# EAGLE design c4-tracker (EAGLE 8.7.1)
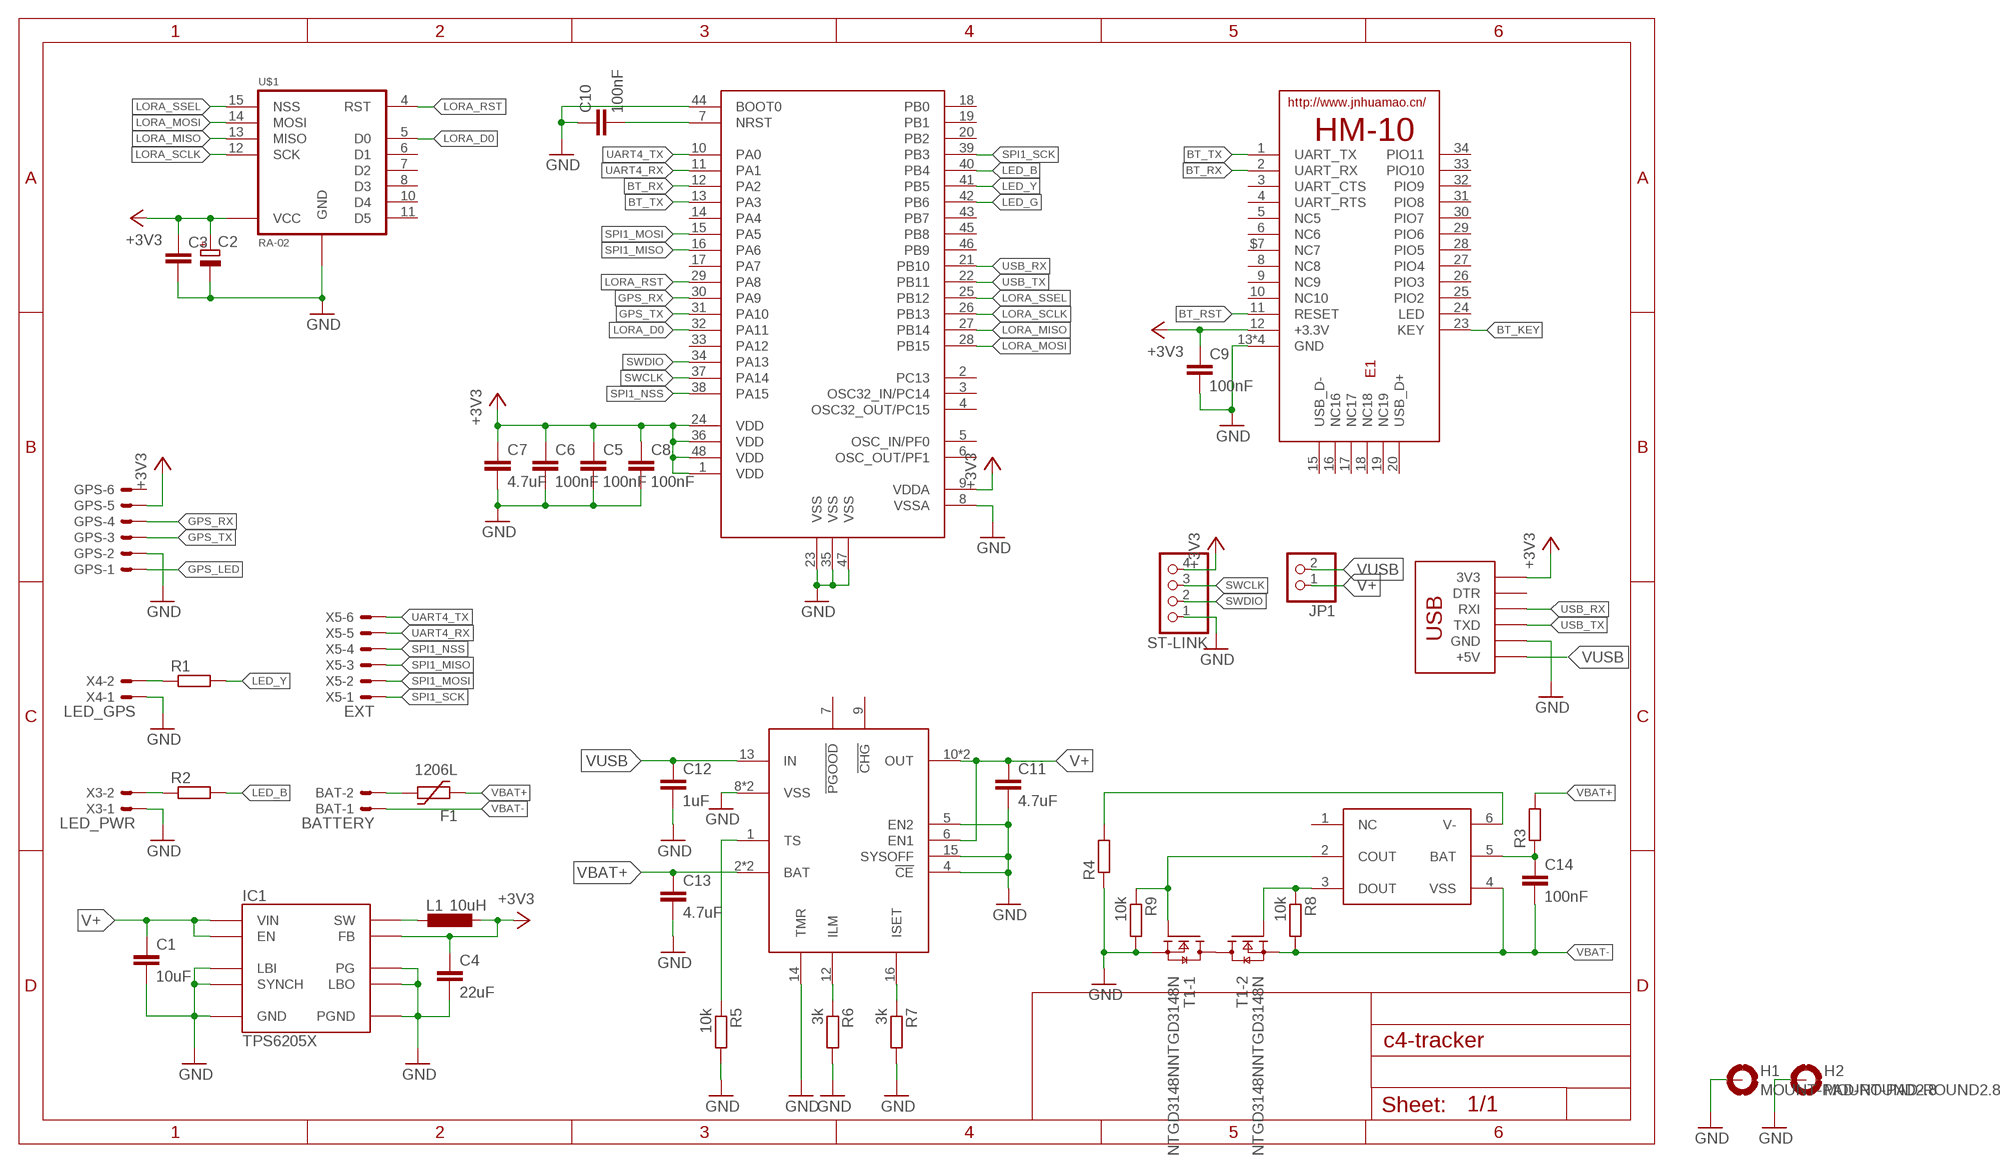
[diagram p0: schematic, sheet 1]

## Parts
BAT  BATTERY  53261-02  [53261-02]
C1  10uF  C-EUC0805  [C0805]
C2  CPOL-EUC  [PANASONIC_C]
C3  C-EUC0805  [C0805]
C4  22uF  C-EUC0805  [C0805]
C5  100nF  C-EUC0805  [C0805]
C6  100nF  C-EUC0805  [C0805]
C7  4.7uF  C-EUC0805  [C0805]
C8  100nF  C-EUC0805  [C0805]
C9  100nF  C-EUC0805  [C0805]
C10  100nF  C-EUC0805  [C0805]
C11  4.7uF  C-EUC0805  [C0805]
C12  1uF  C-EUC0805  [C0805]
C13  4.7uF  C-EUC0805  [C0805]
C14  100nF  C-EUC0805  [C0805]
E1  HM-10-BOARD  [26.9X13X2.2_BOARD]
F1  1206L  [1206L]
GPS  53398-06  [53398-06]
H1  MOUNT-PAD-ROUND2.8  [2,8-PAD]
H2  MOUNT-PAD-ROUND2.8  [2,8-PAD]
IC1  TPS6205X  [VSSOP10]
IC2  BQ24075/9T  [VQFN16]
JP1  PINHD-1X2  [1X02]
L1  10uH  CDRH5D28R  [CDRH5D28R]
MC1  STM32F030CC-48  [LQFP48-7X7]
R1  R-EU_R0805  [R0805]
R2  R-EU_R0805  [R0805]
R3  R-EU_R0805  [R0805]
R4  R-EU_R0805  [R0805]
R5  10k  R-EU_R0805  [R0805]
R6  3k  R-EU_R0805  [R0805]
R7  3k  R-EU_R0805  [R0805]
R8  10k  R-EU_R0805  [R0805]
R9  10k  R-EU_R0805  [R0805]
ST-LINK  PINHD-1X4  [1X04]
T1  NTGD3148NNTGD3148N  [TSOP-6]
U$1  RA-02  [RA-01/RA-02]
U$2  RS232_USB  [CP2102_MICRO_USB_BOARD]
U$3  BQ2970  [WSON6]
X3  LED_PWR  53261-02  [53261-02]
X4  LED_GPS  53261-02  [53261-02]
X5  EXT  53261-06  [53261-06]

## Nets
+3V3: C2.+ C3.1 C4.1 C5.1 C6.1 C7.1 C8.1 C9.1 E1.12(+3.3V) GPS.5 IC1.P$5(FB) L1.1 MC1.1(VDD) MC1.9(VDDA) MC1.24(VDD) MC1.36(VDD) MC1.48(VDD) ST-LINK.4 U$1.3(VCC) U$2.3V3
BT_KEY: E1.23(KEY)
BT_RST: E1.11(RESET)
BT_RX: E1.2(UART_RX) MC1.12(PA2)
BT_TX: E1.1(UART_TX) MC1.13(PA3)
GND: C1.2 C2.- C3.2 C4.2 C5.2 C6.2 C7.2 C8.2 C9.2 C10.1 C11.2 C12.2 C13.2 E1.13(GND) E1.14(GND) E1.21(GND) E1.22(GND) GPS.2 H1.B2,8(MOUNT) H2.B2,8(MOUNT) IC1.P$2(LBO) IC1.P$3(GND) IC1.P$4(PG) IC1.P$6(LBI) IC1.P$7(SYNCH) IC1.P$10(PGND) IC2.4(!CE) IC2.5(EN2) IC2.8(VSS) IC2.14(TMR) IC2.15(SYSOFF) IC2.17(VSS) MC1.8(VSSA) MC1.23(VSS) MC1.35(VSS) MC1.44(BOOT0) MC1.47(VSS) R4.1 R5.2 R6.2 R7.2 R9.2 ST-LINK.1 T1.5(-1:S) U$1.1(GND) U$1.2(GND) U$1.9(GND) U$1.16(GND) U$2.GND X3.1 X4.1
GPS_LED: GPS.1
GPS_RX: GPS.4 MC1.30(PA9)
GPS_TX: GPS.3 MC1.31(PA10)
LED_B: MC1.40(PB4) R2.2
LED_G: MC1.42(PB6)
LED_Y: MC1.41(PB5) R1.2
LORA_D0: MC1.32(PA11) U$1.5(D0)
LORA_MISO: MC1.27(PB14) U$1.13(MISO)
LORA_MOSI: MC1.28(PB15) U$1.14(MOSI)
LORA_RST: MC1.29(PA8) U$1.4(RST)
LORA_SCLK: MC1.26(PB13) U$1.12(SCK)
LORA_SSEL: MC1.25(PB12) U$1.15(NSS)
N$1: C14.1 R3.1 U$3.5(BAT)
N$2: IC1.P$9(SW) L1.2
N$3: IC2.12(ILM) R6.1
N$4: R1.1 X4.2
N$5: BAT.2 F1.P$2
N$6: R2.1 X3.2
N$7: R4.2 U$3.6(V-)
N$8: R9.1 T1.1(-1:G) U$3.2(COUT)
N$9: T1.4(-2:D) T1.6(-1:D)
N$10: R8.1 T1.3(-2:G) U$3.3(DOUT)
N$11: C10.2 MC1.7(NRST)
N$12: IC2.1(TS) R5.1
N$13: IC2.16(ISET) R7.1
SPI1_MISO: MC1.16(PA6) X5.3
SPI1_MOSI: MC1.15(PA5) X5.2
SPI1_NSS: MC1.38(PA15) X5.4
SPI1_SCK: MC1.39(PB3) X5.1
SWCLK: MC1.37(PA14) ST-LINK.3
SWDIO: MC1.34(PA13) ST-LINK.2
UART4_RX: MC1.11(PA1) X5.5
UART4_TX: MC1.10(PA0) X5.6
USB_RX: MC1.21(PB10) U$2.RXI
USB_TX: MC1.22(PB11) U$2.TXD
V+: C1.1 C11.1 IC1.P$1(VIN) IC1.P$8(EN) IC2.6(EN1) IC2.10(OUT) IC2.11(OUT) JP1.1
VBAT+: C13.1 F1.P$1 IC2.2(BAT) IC2.3(BAT) R3.2
VBAT-: BAT.1 C14.2 R8.2 T1.2(-2:S) U$3.4(VSS)
VUSB: C12.1 IC2.13(IN) JP1.2 U$2.+5V
Unconnected: E1.3(UART_CTS) E1.4(UART_RTS) E1.5(NC5) E1.6(NC6) E1.8(NC8) E1.9(NC9) E1.10(NC10) E1.15(USB_D-) E1.16(NC16) E1.17(NC17) E1.18(NC18) E1.19(NC19) E1.20(USB_D+) E1.24(LED) E1.25(PIO2) E1.26(PIO3) E1.27(PIO4) E1.28(PIO5) E1.29(PIO6) E1.30(PIO7) E1.31(PIO8) E1.32(PIO9) E1.33(PIO10) E1.34(PIO11) E1.$7(NC7) GPS.6 IC2.7(!PGOOD) IC2.9(!CHG) MC1.2(PC13) MC1.3(OSC32_IN/PC14) MC1.4(OSC32_OUT/PC15) MC1.5(OSC_IN/PF0) MC1.6(OSC_OUT/PF1) MC1.14(PA4) MC1.17(PA7) MC1.18(PB0) MC1.19(PB1) MC1.20(PB2) MC1.33(PA12) MC1.43(PB7) MC1.45(PB8) MC1.46(PB9) U$1.6(D1) U$1.7(D2) U$1.8(D3) U$1.10(D4) U$1.11(D5) U$2.DTR U$3.1(NC)

## Library data of the parts
BAT X3 X4 = con-molex:53?-02: CONNECTOR wire to board 1.25 mm (.049 inch) pitch header
C1 C3-C14 = rcl:C-EU: CAPACITOR, European symbol; SPICEPREFIX: C
C2 = rcl:CPOL-EU: POLARIZED CAPACITOR, European symbol; SPICEPREFIX: C
E1 = misc:HM-10: HM Bluetooth module use TI CC2540 or CC2541, Master and slave roles in one, transmission version and remote control version and PIO state acquisition functions in one, Support the AT command modify module parameters, Convenient and flexible.
F1 = ptc-littlefuse:1206L
GPS X5 = con-molex:53?-06: CONNECTOR wire to board 1.25 mm (.049 inch) pitch header
H1 H2 = holes:MOUNT-PAD-ROUND: MOUNTING PAD, round
IC1 = misc:TPS6205X
IC2 = misc:BQ24075/9T
JP1 = pinhead:PINHD-1X2: PIN HEADER
L1 = misc:CDRH5D28R
MC1 = stm32:STM32F030CC-48
R1-R9 = rcl:R-EU_: RESISTOR, European symbol; SPICEPREFIX: R
ST-LINK = pinhead:PINHD-1X4: PIN HEADER
T1 = misc:NTGD3148N: 20 V, dual N-channel Trench MOSFET AAL Eindhoven MK
U$1 = lora:RA-02
U$2 = misc:RS232_USB
U$3 = misc:BQ2970

## Board
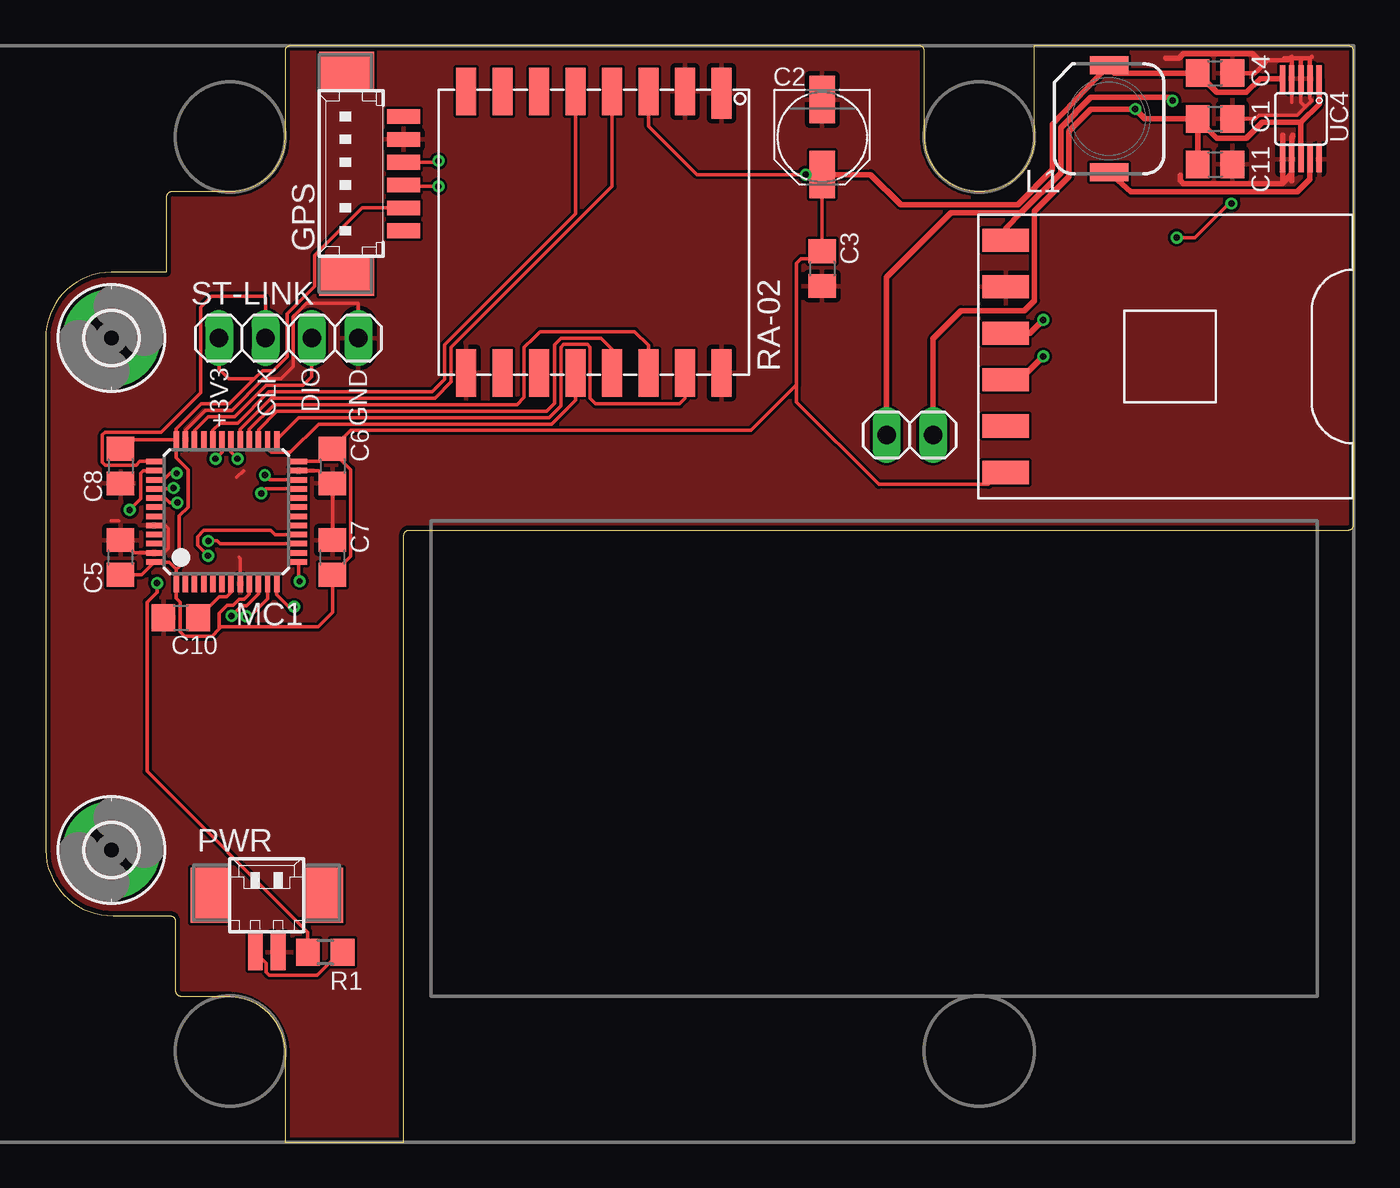
[diagram p1: board, top side]
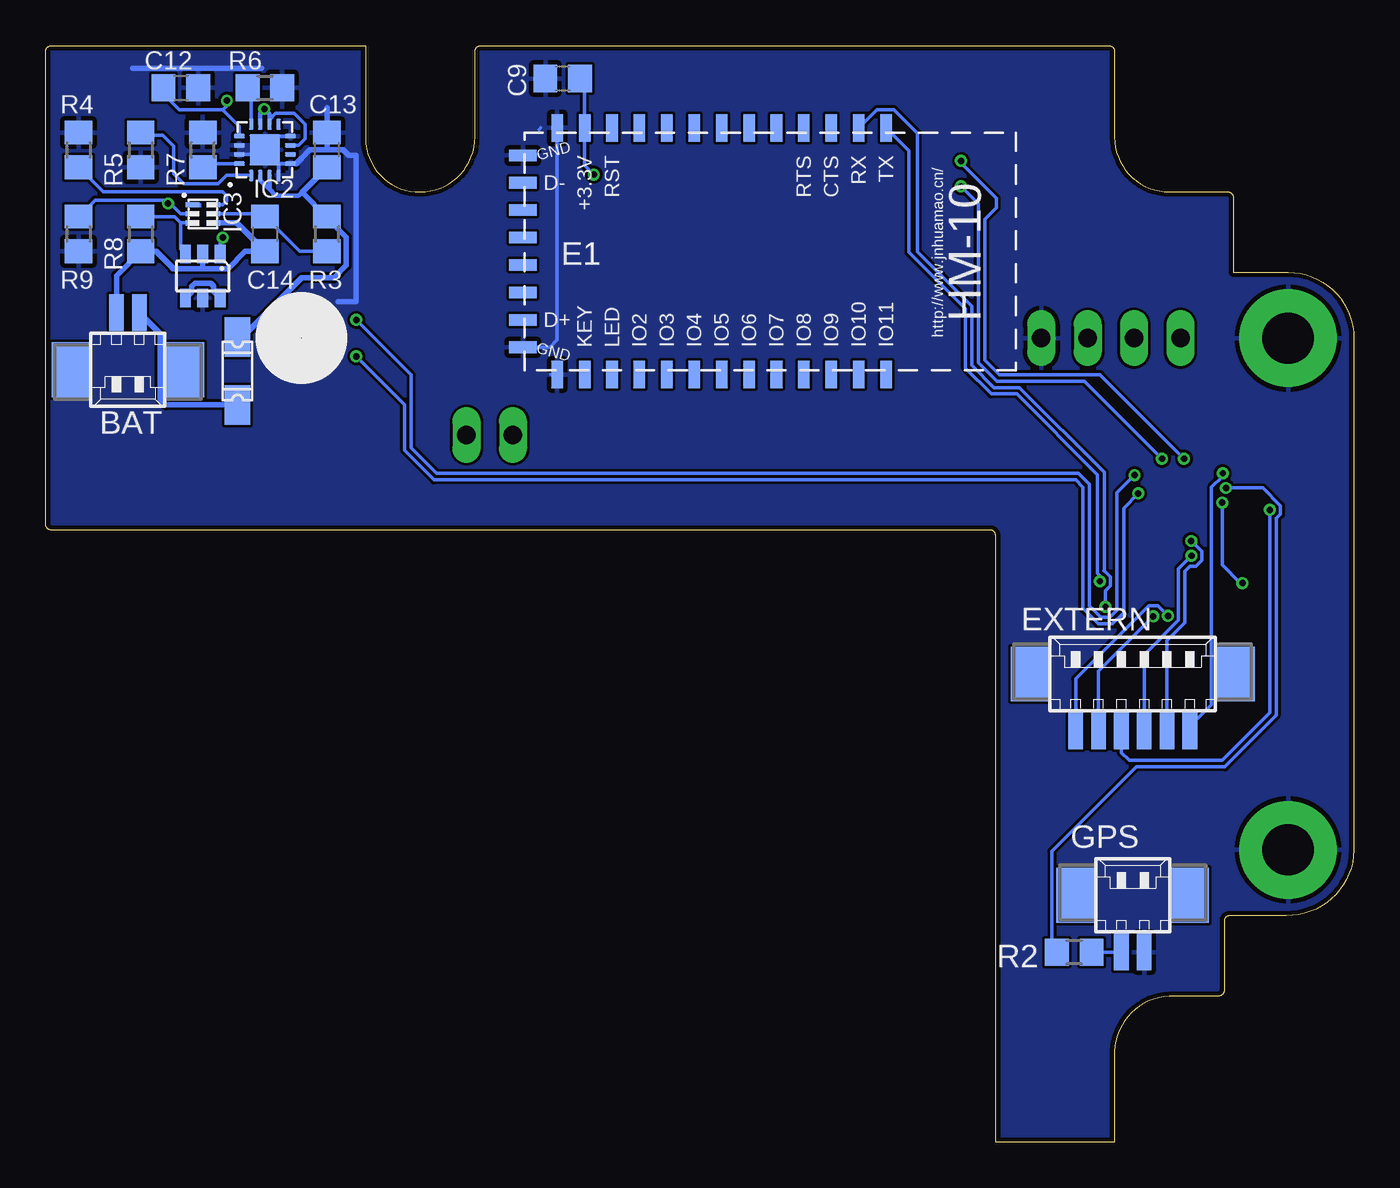
[diagram p2: board, bottom side, seen from below]

Size 71.6 x 60 mm. Coordinates in mm from the lower left corner, seen from the top.
Outline: 0,16 arc90 3.7,12.4 6.8,12.4 arc-90 7.1,12.1 7.1,8.3 arc90 7.4,8 10.1,8 arc-90 13.1,4.7 13.1,0 19.6,0 19.6,33.2 arc-90 19.9,33.5 71.3,33.5 arc90 71.6,33.8 71.6,59.7 arc90 71.3,60 54.1,60 54.1,54.9 arc-90 51.1,52 arc-90 48.1,55 48.1,59.7 arc90 47.8,60 13.4,60 arc90 13.1,59.7 13.1,55 arc-90 10.1,52 6.9,52 arc90 6.6,51.7 6.6,47.6 3.6,47.6 arc90 0,44 0,16
Copper layers (1*16): Top 0.035mm / dielectric 1.5mm / Bottom 0.035mm
Design rules "SeeedStudio_2layer_DRU_no_angle_20140221": minimum track width 6mil, minimum drill 12mil, track to track 6mil, track to pad 6mil, pad to pad 6mil, via to via 6mil, smd to smd 0mil, copper to edge 10mil, drill to drill 10mil, minimum pad ring 10mil, minimum via ring 6mil, stop-mask expansion 2mil, vias tented up to drill 100mil, thermal gap 10mil

### Footprints (pad centres in the part's own frame; a part is rotated, then mirrored left to right if it is on the bottom)
53261-02 = smd 0.8 x 2: 1 0.625,-2.5; 2 -0.625,-2.5 | smd 2.1 x 3: S1 3.125,0.625; S2 -3.125,0.625
C0805 = smd 1.3 x 1.5: 1 -0.95,0; 2 0.95,0
PANASONIC_C = smd 2.6 x 1.4: + 2.05,0; - -2.05,0
26.9X13X2.2_BOARD = smd 1.5 x 0.635: 1 -7.5,0; 2 -7.5,-1.5; 3 -7.5,-3; 4 -7.5,-4.5; 5 -7.5,-6; 6 -7.5,-7.5; 8 -7.5,-10.5; 9 -7.5,-12; 10 -7.5,-13.5; 11 -7.5,-15; 12 -7.5,-16.5; 13 -7.5,-18; 22 6,-18; 23 6,-16.5; 24 6,-15; 25 6,-13.5; 26 6,-12; 27 6,-10.5; 28 6,-9; 29 6,-7.5; 30 6,-6; 31 6,-4.5; 32 6,-3; 33 6,-1.5; 34 6,0; $7 -7.5,-9 | smd 0.635 x 1.5: 14 -6,-19.875; 15 -4.5,-19.875; 16 -3,-19.875; 17 -1.5,-19.875; 18 0,-19.875; 19 1.5,-19.875; 20 3,-19.875; 21 4.5,-19.875
1206L = smd 2.16 x 1.4: P$1 -1.85,0; P$2 1.85,0
53398-06 = smd 0.8 x 1.8: 1 3.125,-2.5; 2 1.875,-2.5; 3 0.625,-2.5; 4 -0.625,-2.5; 5 -1.875,-2.5; 6 -3.125,-2.5 | smd 2.1 x 3: S1 5.625,0.625; S2 -5.625,0.625
2,8-PAD = drill 2.8 pad 5.334: B2,8 0,0
VSSOP10 = smd 0.3 x 1.45: P$1 -1,-2.2; P$2 -0.5,-2.2; P$3 0,-2.2; P$4 0.5,-2.2; P$5 1,-2.2; P$6 1,2.2; P$7 0.5,2.2; P$8 0,2.2; P$9 -0.5,2.2; P$10 -1,2.2
VQFN16 = smd 0.6 x 0.24: 1 -1.4,0.75; 2 -1.4,0.25; 3 -1.4,-0.25; 4 -1.4,-0.75; 9 1.4,-0.75; 10 1.4,-0.25; 11 1.4,0.25; 12 1.4,0.75 | smd 0.24 x 0.6: 5 0.75,-1.4; 6 0.25,-1.4; 7 -0.25,-1.4; 8 -0.75,-1.4; 13 0.75,1.4; 14 0.25,1.4; 15 -0.25,1.4; 16 -0.75,1.4 | smd 1.68 x 1.68: 17 0,0
1X02 = drill 1.016 long: 1 -1.27,0; 2 1.27,0
CDRH5D28R = smd 2.1 x 1: 1 0,2.927; 2 0,-2.927
LQFP48-7X7 = smd 0.9 x 0.3: 1 -3.95,2.75; 2 -3.95,2.25; 3 -3.95,1.75; 4 -3.95,1.25; 5 -3.95,0.75; 6 -3.95,0.25; 7 -3.95,-0.25; 8 -3.95,-0.75; 9 -3.95,-1.25; 10 -3.95,-1.75; 11 -3.95,-2.25; 12 -3.95,-2.75; 25 3.95,-2.75; 26 3.95,-2.25; 27 3.95,-1.75; 28 3.95,-1.25; 29 3.95,-0.75; 30 3.95,-0.25; 31 3.95,0.25; 32 3.95,0.75; 33 3.95,1.25; 34 3.95,1.75; 35 3.95,2.25; 36 3.95,2.75 | smd 0.3 x 0.9: 13 -2.75,-3.95; 14 -2.25,-3.95; 15 -1.75,-3.95; 16 -1.25,-3.95; 17 -0.75,-3.95; 18 -0.25,-3.95; 19 0.25,-3.95; 20 0.75,-3.95; 21 1.25,-3.95; 22 1.75,-3.95; 23 2.25,-3.95; 24 2.75,-3.95; 37 2.75,3.95; 38 2.25,3.95; 39 1.75,3.95; 40 1.25,3.95; 41 0.75,3.95; 42 0.25,3.95; 43 -0.25,3.95; 44 -0.75,3.95; 45 -1.25,3.95; 46 -1.75,3.95; 47 -2.25,3.95; 48 -2.75,3.95
R0805 = smd 1.3 x 1.5: 1 -0.95,0; 2 0.95,0
1X04 = drill 1.016 long: 1 -3.81,0; 2 -1.27,0; 3 1.27,0; 4 3.81,0
TSOP-6 = smd 0.6 x 1: 1 -0.95,-1.2; 2 0,-1.2; 3 0.95,-1.2; 4 0.95,1.2; 5 0,1.2; 6 -0.95,1.2
RA-01/RA-02 = smd 2.8 x 1.1: 1 -7.6,7 | smd 2.6 x 1.1: 2 -7.7,5; 3 -7.7,3; 4 -7.7,1; 5 -7.7,-1; 6 -7.7,-3; 7 -7.7,-5; 8 -7.7,-7; 9 7.7,-7; 10 7.7,-5; 11 7.7,-3; 12 7.7,-1; 13 7.7,1; 14 7.7,3; 15 7.7,5; 16 7.7,7
CP2102_MICRO_USB_BOARD = smd 2.54 x 1.27: 3V3 8.75,6.35; +5V 8.75,-6.35; DTR 8.75,3.81; GND 8.75,-3.81; RXI 8.75,1.27; TXD 8.75,-1.27
WSON6 = smd 0.28 x 0.75: 1 -0.5,-0.575; 2 0,-0.575; 3 0.5,-0.575; 4 0.5,0.575; 5 0,0.575; 6 -0.5,0.575
53261-06 = smd 0.8 x 2: 1 3.125,-2.5; 2 1.875,-2.5; 3 0.625,-2.5; 4 -0.625,-2.5; 5 -1.875,-2.5; 6 -3.125,-2.5 | smd 2.1 x 3: S1 5.625,0.625; S2 -5.625,0.625

### Placement (x,y rotation side)
BAT  67.1,42.9 180 bottom
C1  64,56 0 top
C2  42.5,55 270 top
C3  42.5,47.8 270 top
C4  64,58.5 0 top
C5  4.1,32 90 top
C6  15.7,37 270 top
C7  15.7,32 90 top
C8  4.1,37 270 top
C9  43.3,58.2 180 bottom
C10  7.4,28.7 0 top
C11  64,53.5 0 top
C12  64.2,57.7 0 bottom
C13  56.2,54.3 90 bottom
C14  59.6,49.7 270 bottom
E1  25.6,48 270 bottom
F1  61.1,42.2 270 bottom
GPS  17.1,53 90 top
H1  3.6,16 0 top
H2  3.6,44 0 top
IC1  68.7,56 180 top
IC2  59.6,54.3 90 bottom
JP1  47.3,38.7 180 top
L1  58.2,56 0 top
MC1  9.9,34.5 90 top
R1  15.3,10.4 180 top
R2  15.3,10.4 180 bottom
R3  56.2,49.7 90 bottom
R4  69.8,54.3 270 bottom
R5  66.4,54.3 270 bottom
R6  59.6,57.7 0 bottom
R7  63,54.3 90 bottom
R8  66.4,49.7 270 bottom
R9  69.8,49.7 270 bottom
ST-LINK  13.3,44 180 top
T1  63,47.4 180 bottom
U$1  30,49.8 270 top
U$2  61.3,43 180 top
U$3  63,50.8 270 bottom
X3  12.1,12.9 0 bottom
X4  12.1,12.9 0 top
X5  12.1,25 0 bottom

### Tracks (layer width: path | path; a pad name or v marks a point on that pad's centre or on a via)
+3V3  (via drill 0.35)
  Top 0.2: 7.2,30.6 MC1.1 | C6.1 16.1,37.81 | 16.1,31.19 C7.1 | C6.1 15.83,38.08 15.83,37.68 16.7,36.8 16.7,32.05 C7.1 | MC1.24 15,37.25 C6.1 | 4.62,38.48 C8.1 4.6,38.45 MC1.36 | 9.5,44.51 ST-LINK.4 9.49,42.29 10.01,41.77 11.42,41.77 | MC1.1 7.15,31.35 | 7.15,31.35 6.75,31.75 MC1.48 5.25,31.05 C5.1 | MC1.36 7.15,39.05 8.51,40.41 10.06,40.41 11.42,41.77 | MC1.36 7.15,37.45 7.79,36.81 7.79,34.76 7.3,34.27 7.3,31.5 7.15,31.35 | C6.1 16.7,38.95 38.6,38.95 41.1,41.45 | C7.1 15.7,29 14.9,28.2 9.61,28.2 9.5,28.1 | MC1.1 7.15,29.76 7.35,29.55 7.35,27.94 7.6,27.7 9.1,27.7 9.5,28.1 | 41.1,41.45 41.1,48.1 41.35,48.35 42.1,48.35 C3.1 C2.+ v41.6,52.95 35.65,52.95 33,55.6 U$1.3 | 11.42,41.77 11.87,42.22 12.45,42.22 13.2,42.98 13.2,45.33 14.72,46.85 14.72,48.53 17.32,51.12 GPS.5 | U$2.3V3 52.55,36.95 51.6,36 45.6,36 41.1,40.5 41.1,41.45 | MC1.9 11.15,30 10.86,29.71 10.59,29.71 10.26,29.38 9.93,29.38 9.5,28.95 9.5,28.1
  Top 0.3: IC1.P$5 66.48,58.2 65.72,57.45 64.1,57.45 C4.1 58.5,58.5 L1.1 55.1,55.7 55.1,53.2 53.2,51.3 46.8,51.3 45.15,52.95 C2.+
  Bottom 0.2: 42.1,55.99 E1.12 | 42.18,55.5 E1.12 | E1.12 42.1,57.95 C9.1 | E1.12 42.1,53.45 v41.6,52.95
BT_RX  (via drill 0.35)
  Top 0.2: MC1.12 12.65,29.95 13.3,29.3 v13.6,29.3
  Bottom 0.2: 22.6,47.45 23.87,48.73 23.87,55.2 25.18,56.5 26.1,56.5 E1.2 | 22.6,47.45 22.59,47.46 | 22.6,47.45 20.91,45.76 20.91,42.51 19.69,41.3 18.3,41.3 13.66,36.66 13.66,31.28 | 13.66,31.28 13.32,30.94 13.32,30.46 13.6,30.18 v13.6,29.3 | 13.66,31.28 13.68,31.28
BT_TX  (via drill 0.35)
  Top 0.2: MC1.13 13.85,30.75 v13.9,30.7
  Bottom 0.2: E1.1 24.35,54.25 24.35,48.71 21.26,45.61 21.26,42.36 19.84,40.94 18.44,40.94 14.03,36.53 14.03,31.13 13.9,31 v13.9,30.7
GND
  Top 0.2: 42.5,46.99 C3.2 42.48,46.83 42.5,46.8 42.5,46.35 | C7.2 16.02,33.02 | 10.47,36.38 10.84,36.75 | C6.2 15.7,36 | 15.7,36 C7.2 | 15.7,32.81 C7.2 | MC1.23 14.95,36.75 15.7,36 | 4,34 3.6,34 | ST-LINK.1 17.1,45.9 14.27,45.9 13.56,45.18 13.56,42.42 12.9,41.77 11.92,41.77 10.2,40.05 8.76,40.05 7.65,38.95 MC1.35 | C5.2 4.8,32.25 MC1.47 6.45,32.25 6.7,32.5 6.7,33.6 6.55,33.75 MC1.44 | IC1.P$4 68.2,56.9 | IC1.P$2 69.2,57.1 69.3,57 68.95,56.65 | 68.95,56.65 68.5,56.2 66.41,56.2 66.21,56 C1.2 | MC1.8 10.65,31.95 10.6,32 | IC1.P$3 68.7,56.9 68.95,56.65
  Top 0.254: IC1.P$4 68.2,59.4 68,59.2 67.7,59.2 | C4.2 66.17,58.5 66.63,58.97 66.88,59.2 67.7,59.2 | IC1.P$3 68.7,59.2 68.8,59.3 | 68.8,59.3 67.8,59.3 67.7,59.2 | IC1.P$2 69.2,59.3 | 69.3,59.4 69.2,59.3 | 69.2,59.3 68.8,59.3
  Top 0.3: 68.2,53 IC1.P$7 68.2,55 68.25,55.05 68.25,55.1 | 68.2,53 68.2,52.6 | 67.7,52.6 IC1.P$6 67.7,55.1 | 62.1,52.9 62.1,52.62 62.27,52.45 67.65,52.45 68.2,53 | 61.3,59.3 62.02,59.3 62.27,59.55 66.05,59.55 66.63,58.97
  Bottom 0.152: E1.22 43.98,42
  Bottom 0.2: 44.5,55.5 44.6,55.4 | 43.6,55.6 43.6,43.9 44,43.5 E1.21 | IC2.8 58.85,53.55 | 58.85,53.55 IC2.17 | IC2.4 58.85,53.55 | IC2.5 58.85,55.05 IC2.17 | IC2.17 60.1,53.8 60.35,54.05 IC2.15
  Bottom 0.3: 59.77,58.75 66.85,58.75 | 57.88,53.55 57.6,53.83 57.6,53.85 57.15,54.3 56.2,54.3 | 55.6,46 54.6,46 54.6,54 55.02,54 55.32,54.3 56.2,54.3 | 56.2,56.6 C13.2 56.2,54.3
  pour Top: -10.4,60 -10.4,0 71.6,0 71.6,60
  pour Bottom: -10.4,60 71.6,60 71.6,0 -10.4,0
GPS_RX  (via drill 0.35)
  Top 0.2: MC1.30 10.15,37.75 v10.5,37.4 | GPS.4 19.67,52.3 v21.5,52.3
  Bottom 0.2: v10.5,37.4 14.75,41.65 19.55,41.65 20.55,42.65 20.55,51.35 v21.5,52.3
GPS_TX  (via drill 0.35)
  Top 0.2: MC1.31 9.65,37.75 v9.3,37.4 | GPS.3 21.42,53.62 v21.5,53.7
  Bottom 0.2: v9.3,37.4 13.9,42 19.4,42 20.2,42.8 20.2,50.51 19.57,51.14 19.57,51.66 21.5,53.59 v21.5,53.7
LED_B  (via drill 0.35)
  Top 0.2: MC1.40 6.95,35.75 v7,35.8
  Bottom 0.2: v7,35.8 4.98,35.8 4.02,34.84 4.02,34.36 4.25,34.13 4.25,23.35 6.9,20.7 7.05,20.55 11.9,20.55 16.53,15.92 16.53,10.68 R2.2
LED_Y  (via drill 0.35)
  Top 0.2: v7.21,35 6.8,35 6.55,35.25 MC1.41 | R1.2 14.35,11.49 5.55,20.3 5.55,29.55 6.1,30.11 v6.1,30.6
  Bottom 0.2: v7.21,35 7.21,31.61 6.2,30.6 v6.1,30.6
LORA_D0
  Top 0.2: MC1.32 9.15,38.95 9.55,39.35 10.49,39.35 12.21,41.06 21.16,41.06 21.84,41.75 21.84,43.65 29,50.8 U$1.5
LORA_MISO
  Top 0.2: MC1.27 11.65,39 12.65,40.01 27.41,40.01 27.84,40.44 27.84,43.65 28.2,44.01 30.4,44.01 31,43.4 U$1.13
LORA_MOSI
  Top 0.2: MC1.28 11.15,39.01 12.5,40.36 25.8,40.36 26.2,40.76 26.2,43.51 26.69,44 26.7,44 27.06,44.36 32.24,44.36 33,43.6 U$1.14
LORA_RST
  Top 0.2: MC1.29 10.65,39.01 12.35,40.71 21.31,40.71 22.2,41.6 22.2,43.51 31,52.31 U$1.4
LORA_SCLK
  Top 0.2: MC1.26 12.15,37.95 12.35,37.75 13.39,37.75 14.94,39.3 27.7,39.3 29,40.6 U$1.12
LORA_SSEL
  Top 0.2: 12.7,38.4 MC1.25 13.85,39.65 27.55,39.65 28.2,40.3 28.2,43.51 28.34,43.65 29.66,43.65 29.8,43.51 29.8,40.7 30.1,40.4 34.7,40.4 34.95,40.65 35,40.7 U$1.15
N$1
  Bottom 0.2: R3.1 57.7,48.75 C14.1 59.75,50.8 U$3.5
N$2
  Top 0.3: IC1.P$9 69.2,52.7 68.49,51.99 59.41,51.99 L1.2
N$3
  Bottom 0.2: IC2.12 60.35,57.5 R6.1
N$4
  Top 0.2: R1.1 16.11,10.4 14.85,9.15 12.22,9.15 12.07,9.29 12.07,9.8 X4.2
N$5
  Bottom 0.3: F1.P$2 65.03,40.35 65.33,40.65 65.33,44.25 BAT.2
N$6
  Bottom 0.2: R2.1 X3.2
N$7
  Bottom 0.2: R4.2 68.45,52 63.6,52 63.13,52 61.9,52 61.7,51.8 61.7,51.5 61.9,51.3 U$3.6
N$8  (via drill 0.35)
  Top 0.2: v61.9,49.5 62.9,49.5 64.7,51.3 64.83,51.3 v64.9,51.37
  Bottom 0.2: U$3.2 64.2,50.8 64.9,51.5 | R9.1 68.9,51.55 64.95,51.55 64.9,51.5 | T1.1 62.05,49.35 v61.9,49.5 | v64.9,51.37 64.9,51.5
N$9
  Bottom 0.3: T1.6 62.4,46.55 62.4,46.83 62.57,47 63.43,47 63.6,46.83 63.6,46.55 T1.4
N$10
  Bottom 0.2: U$3.3 64,50.3 | 64,50.3 U$3.3 | 64.2,50.3 U$3.3 | T1.3 64.2,48.85 64.2,50.3 | 64.2,50.3 64.55,50.65 R8.1
N$11
  Top 0.2: C10.2 9.5,29.85 9.9,29.85 10.15,30.09 MC1.7
N$12
  Bottom 0.2: IC2.1 61.69,52.9 62.15,52.45 64.05,52.45 64.6,53 64.6,54.5 65.2,55.1 66.25,55.1 R5.1
N$13
  Bottom 0.2: IC2.16 62.8,53.55 R7.1
SPI1_MISO  (via drill 0.35)
  Top 0.2: v8.89,32.09 8.32,32.66 8.32,33.14 8.66,33.48 12.32,33.48 12.55,33.25 MC1.16
  Bottom 0.2: 11.18,21.7 11.5,21.7 11.5,22.48 X5.3 11.47,22.7 11.47,23.07 11.47,26.68 9.59,28.56 9.59,31.39 v8.89,32.09
SPI1_MOSI  (via drill 0.35)
  Top 0.2: MC1.15 9.55,32.75 9.4,32.9 v8.9,32.9
  Bottom 0.2: 10.22,21.93 X5.2 10.22,27.43 9.24,28.41 9.24,31.24 8.97,31.51 8.65,31.51 8.31,31.85 8.31,32.33 8.65,32.67 8.67,32.67 v8.9,32.9
SPI1_NSS  (via drill 0.35)
  Top 0.2: v4.6,34.6 5.2,35.2 5.2,36.6 5.35,36.75 MC1.38
  Top 0.3: 4.6,34.72 v4.6,34.6
  Bottom 0.2: X5.4 12.72,21.32 12.3,20.9 7.2,20.9 4.6,23.5 v4.6,34.6
SPI1_SCK  (via drill 0.35)
  Top 0.2: MC1.39 6.45,36.25 6.81,36.61 v7.17,36.61
  Bottom 0.2: X5.1 9.1,22.62 7.79,23.94 7.79,35.83 7.17,36.45 v7.17,36.61
SWCLK
  Top 0.2: ST-LINK.3 12.03,46.17 11.9,46.3 9.09,46.3 8.48,45.68 8.48,41 6.33,38.85 3.24,38.85 3.1,38.7 3.1,37.2 3.24,37.05 4.96,37.05 5.16,37.25 MC1.37
SWDIO
  Top 0.2: MC1.34 8.15,38.95 8.9,39.7 10.35,39.7 12.06,41.41 14.1,41.41 14.57,41.88 ST-LINK.2
UART4_RX  (via drill 0.35)
  Top 0.2: MC1.11 12.15,29.75 11.18,28.78 v10.98,28.78
  Bottom 0.2: X5.5 13.97,23 13.97,23.01 13.97,25.78 v10.98,28.78
UART4_TX  (via drill 0.35)
  Top 0.2: MC1.10 11.65,30 11.01,29.36 10.74,29.36 v10.18,28.8 v10.17,28.8
  Bottom 0.2: 15.03,21.8 15.3,21.8 15.22,21.88 X5.6 15.22,25.35 11.22,29.36 10.74,29.36 v10.18,28.8 v10.17,28.8
USB_RX  (via drill 0.35)
  Top 0.2: MC1.21 12.05,35.75 v11.8,35.5
  Top 0.3: v54.6,43 53.33,41.73 U$2.RXI
  Bottom 0.2: v11.8,35.5 12.6,34.7 12.6,28.98 13.21,28.37 13.99,28.37 14.83,29.21 14.83,35.85 15.23,36.25 50.35,36.25 51.95,37.85 51.95,40.35 v54.6,43
USB_TX  (via drill 0.35)
  Top 0.2: 13.9,36.25 MC1.22 12.25,36.25 v12,36.5
  Top 0.3: U$2.TXD 53.87,44.27 v54.6,45
  Bottom 0.2: v12,36.5 12.97,35.53 12.97,29.11 13.36,28.72 13.84,28.72 14.48,29.36 14.48,36 15.08,36.6 50.2,36.6 51.6,38 51.6,42 v54.6,45
V+  (via drill 0.35)
  Top 0.3: IC1.P$1 69.7,56.8 68.7,55.8 | 68.7,55.8 IC1.P$8 | C11.1 C1.1 | 68.7,55.8 66.58,55.8 65.72,54.95 64.1,54.95 C1.1 | C1.1 60.17,56 v59.64,56.54 57.21,56.54 56.01,55.33 56.01,52.83 54.12,50.94 54.12,46.05 53.57,45.5 50.1,45.5 48.57,43.97 JP1.1 48.6,38.73
  Bottom 0.2: IC2.10 59.35,55.95 59,56.3 58,56.3 57.4,55.7 57.4,54.9 57.75,54.55 IC2.6 | v59.64,56.54 59.6,56.5
  Bottom 0.254: IC2.10 59.35,56.25 v59.64,56.54 59.85,56.32 IC2.11
VBAT+
  Bottom 0.2: 56.25,50.65 R3.2
  Bottom 0.254: IC2.3 59.35,52.15 | 59.35,52.15 59,51.8 57.75,51.8 57.57,51.98 | IC2.2 59.85,52.65 59.35,52.15
  Bottom 0.3: C13.1 57.57,51.98 56.25,50.65 | R3.2 56.2,50.58 55.15,49.52 55.15,47.98 55.82,47.3 57.6,47.3 60.85,44.05 F1.P$1
VBAT-
  Bottom 0.3: 67.72,44.73 BAT.1 67.72,47.42 R8.2 65.55,48.75 64.6,47.8 | U$3.4 61.15,50.3 C14.2 60.67,48.75 61.63,47.8 63.1,47.8 | 64.6,47.8 64.38,47.8 63.1,47.8 | 64.6,47.8 64.65,47.8 | T1.2 63,47.9 63.1,47.8
VUSB  (via drill 0.35)
  Top 0.2: v61.68,57 61.51,57.17 61.43,57.17
  Top 0.3: JP1.2 46.03,47.33 49.55,50.85 53.39,50.85 | 53.39,50.85 55.55,53.01 55.55,55.51 57.21,57.17 61.43,57.17 61.6,57 | U$2.+5V 52.55,50.01 53.39,50.85
  Bottom 0.2: IC2.13 61,55.6 61.9,56.5 | 61.9,56.5 64.3,56.5 65.15,57.35 C12.1 | 61.9,56.5 61.68,56.72 v61.68,57

### Text on the board
tNames: C4 | C2 | UC4 | C1 | C11 | C3 | +3V3 | CLK | DIO | GND | C6 | C8 | C7 | C5 | C10 | PWR
bNames: IC3 | EXTERN | GPS
bValues: IC3
tDocu: 9V BLOCK